# Altium schematic sheet [1]-POWER.SchDoc
size A
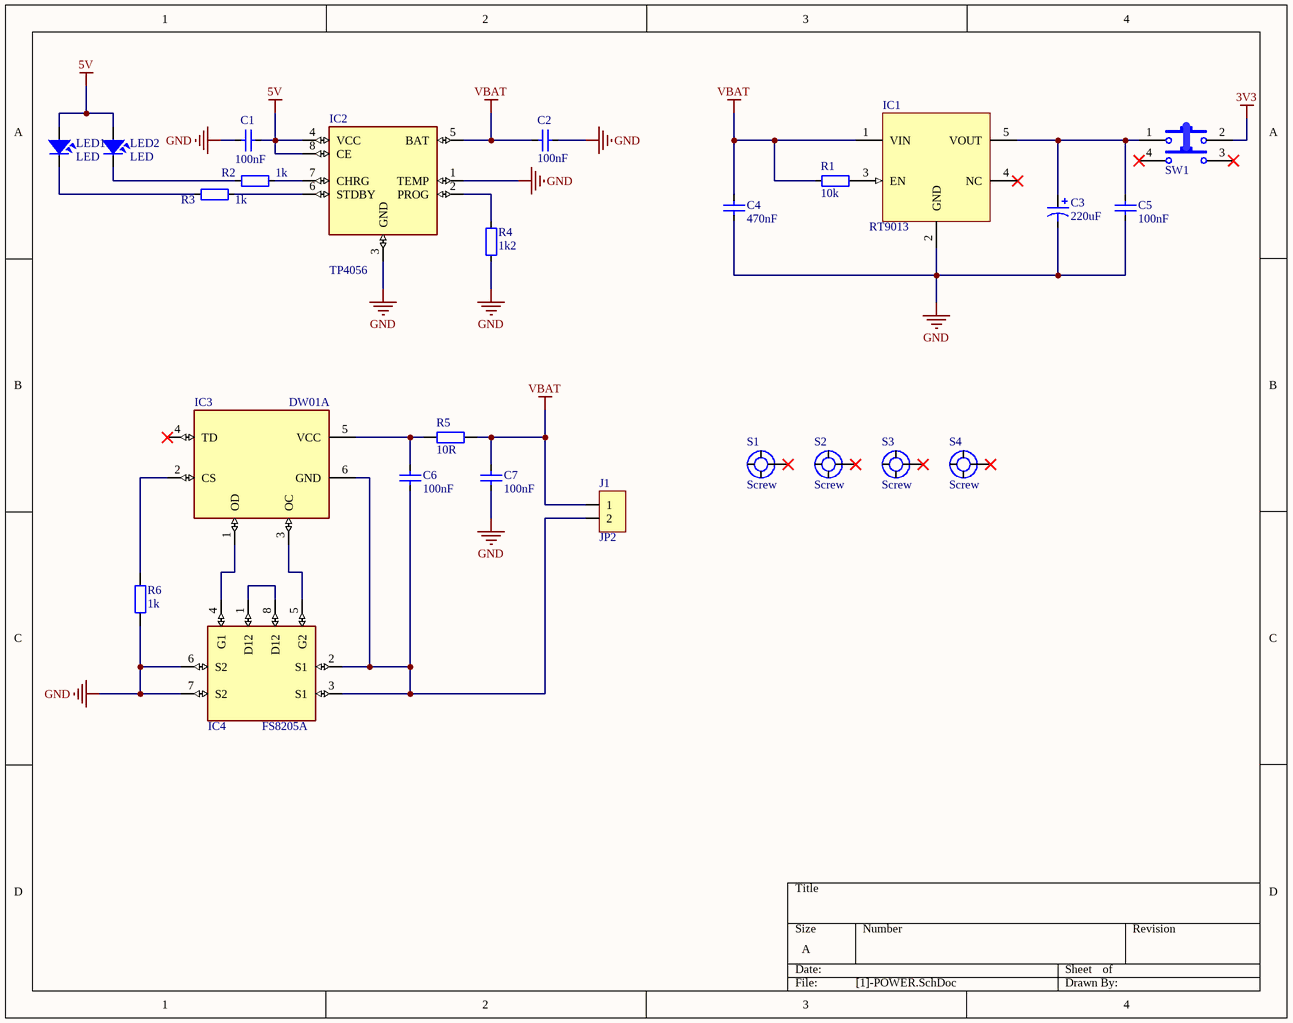
[diagram p0: [1]-POWER.SchDoc]

## Parts
C1  100nF  [CAP_0805]
C2  100nF  [CAP_0805]
C3  220uF  [CAP_TANTALUM_3216]
C4  470nF  [CAP_0805]
C5  100nF  [CAP_0805]
C6  100nF  [CAP_0805]
C7  100nF  [CAP_0805]
IC1  RT9013  [SOT23-5]
IC2  TP4056  [SOP127P600X175-9N]
IC3  DW01A  [SOT23-6]
IC4  FS8205A  [FS8205A]
J1  JP2  [CON2]
LED1  LED  [LED-0805-Red]
LED2  LED  [LED-0805-Green]
R1  10k  [RES-SMD-0805]
R2  1k  [RES-SMD-0805]
R3  1k  [RES-SMD-0805]
R4  1k2  [RES-SMD-0805]
R5  10R  [RES-SMD-0805]
R6  1k  [RES-SMD-0805]
S1  Screw  [Screw 3 small]
S2  Screw  [Screw 3 small]
S3  Screw  [Screw 3 small]
S4  Screw  [Screw 3 small]
SW1  SW-4P-B  [SW-4P-B]  (value not drawn)

## Nets
3V3: SW1.2
5V: C1.1 IC2.4(VCC) IC2.8(CE) LED1.1 LED2.1
GND: C1.2 C2.1 C3.2 C4.2 C5.2 C7.1 IC1.2(GND) IC2.1(TEMP) IC2.3(GND) IC4.6(S2) IC4.7(S2) R4.1 R6.2
VBAT: C2.2 C4.1 C7.2 IC1.1(VIN) IC2.5(BAT) J1.1 R1.2 R5.2
NetC3_1: C3.1 C5.1 IC1.5(VOUT) SW1.1
NetC6_1: C6.1 IC3.6(GND) IC4.2(S1) IC4.3(S1) J1.2
NetC6_2: C6.2 IC3.5(VCC) R5.1
NetIC1_3: IC1.3(EN) R1.1
NetIC2_2: IC2.2(PROG) R4.2
NetIC2_6: IC2.6(STDBY) R3.1
NetIC2_7: IC2.7(CHRG) R2.1
NetIC3_1: IC3.1(OD) IC4.4(G1)
NetIC3_2: IC3.2(CS) R6.1
NetIC3_3: IC3.3(OC) IC4.5(G2)
NetIC4_1: IC4.1(D12) IC4.8(D12)
NetLED1_2: LED1.2 R3.2
NetLED2_2: LED2.2 R2.2

Not connected (* = marked no-connect by the designer): IC1 4(NC)*; IC3 4(TD)*; S1 1*; S2 1*; S3 1*; S4 1*; SW1 3* 4*

## Library data of the parts
C1 C2 C4-C7 = CapSMD: Capacitor; Value: 33p; Published: 8-Jun-2000; LatestRevisionDate: 17-Jul-2002; LatestRevisionNote: Re-released for DXP Platform.; PackageReference: RAD-0.3; Publisher: Altium Limited
C3 = Cap Pol: Polarized Capacitor (Axial); Published: 8-Jun-2000; LatestRevisionDate: 17-Jul-2002; LatestRevisionNote: Re-released for DXP Platform.; PackageReference: POLAR0.8; Publisher: Altium Limited
IC1 = RT9013: RT9013-33GB IC REG LINEAR 3.3V 500mA SOT23-5
IC2 = TP4056: Complete single cell Li-Ion battery with a constant current / constant voltage linear charger
IC3 = DW01A: One Cell Lithium-ion/Polymer Battery Protection IC
J1 = JP2: WR-PHD 2.54 mm Angled Socket Header; Manufacturer: W¨¹rth Elektronik eiSos GmbH; partNo: 613002143121; ComponentLink1 Description: Manufacturer; ComponentLink2 Description: Datasheet; NoPins: 02; Created Date: 29 March 2013; ComponentLink1URL: http://www.we-online.com; ComponentLink2URL: http://katalog.we-online.de/em/datasheet/6130xx143121.pdf; Created by: Karrer Zheng
LED1 LED2 = LED: LED Single colour Green and Red; Value: LED 3 ly Single Colour
R1-R4 = Resistor - SMD: Resistor; Manufacturer: Generic Components; Class: Passive; Published: 08/06/2000; Publisher: Altium Hobart Technology Centre
R5 R6 = Resistor - SMD: Resistor SMD; Manufacturer: Generic Components; Class: Passive; Published: 08/06/2000; Publisher: Altium Hobart Technology Centre
SW1 = SW-4PIN-BIG: Switch Big 4 Pin; Published: 24-Mar-1999; LatestRevisionDate: 17-Jul-2002; LatestRevisionNote: Re-released for DXP Platform.; PackageReference: SPST-2; Publisher: Altium Limited